# Altium schematic sheet SCH Front Conexion.SchDoc
size Legal; SheetNumber: 3; SheetTotal: 3
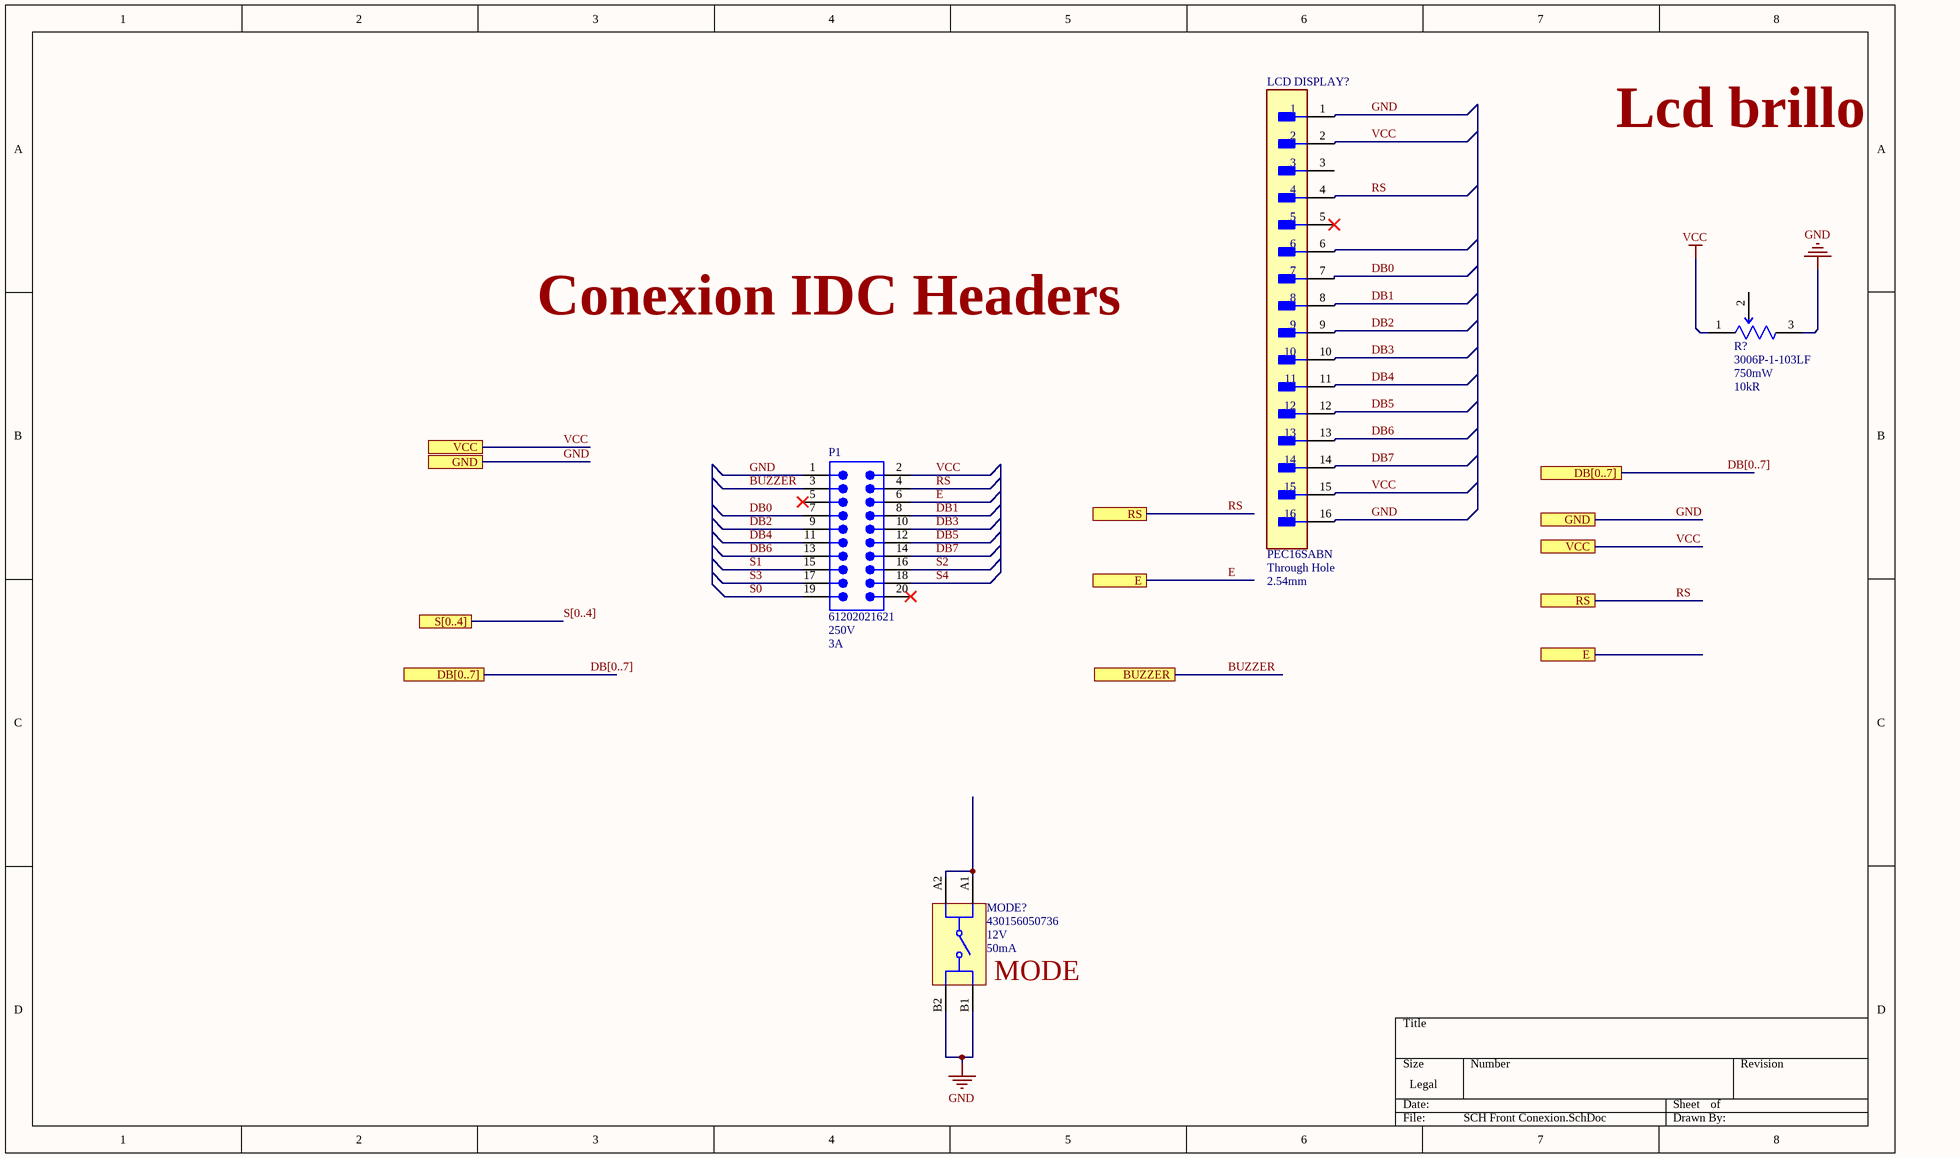
[diagram p0: SCH Front Conexion.SchDoc]

## Parts
LCD_DISPLAY?  PEC16SABN  Mount: Through Hole  Height: 2.54mm  [FP-PEC16SABN-MFG]
MODE?  430156050736  Voltage Rating: 12V  Current Rating: 50mA  [4301x60507x6]
P1  61202021621  Voltage Rating (DC): 250V  Current Rating: 3A  [61202021621]
R?  3006P-1-103LF  Power Rating: 750mW  Resistance: 10kR  [FP-3006P-MFG]

## Ports
BUZZER, DB[0..7], E, GND, RS, S[0..4], VCC

## Nets
GND: LCD_DISPLAY?.1 LCD_DISPLAY?.16 MODE?.B1 MODE?.B2 P1.1 R?.3(CW) ; port GND
VCC: LCD_DISPLAY?.2 LCD_DISPLAY?.15 P1.2 R?.1(CCW) ; port VCC
BUZZER: P1.3 ; port BUZZER
DB0: LCD_DISPLAY?.7 P1.7
DB1: LCD_DISPLAY?.8 P1.8
DB2: LCD_DISPLAY?.9 P1.9
DB3: LCD_DISPLAY?.10 P1.10
DB4: LCD_DISPLAY?.11 P1.11
DB5: LCD_DISPLAY?.12 P1.12
DB6: LCD_DISPLAY?.13 P1.13
DB7: LCD_DISPLAY?.14 P1.14
E: P1.6 ; port E
RS: LCD_DISPLAY?.4 P1.4 ; port RS
S0: P1.19
S1: P1.15
S2: P1.16
S3: P1.17
S4: P1.18
NetMODE?_A1: MODE?.A1 MODE?.A2

Not connected (* = marked no-connect by the designer): LCD_DISPLAY? 3 5* 6; P1 5* 20*; R? 2(WIPER)

## Buses and harness runs
bus DB[0..7] = port DB[0..7]
bus S[0..4] = port S[0..4]

## Notes on the sheet
- Lcd brillo
- Conexion IDC Headers
- (near MODE?) MODE

## Library data of the parts
LCD_DISPLAY? = CMP-25680-000075-1: CONN HEADER VERT 16POS 2.54MM; Gender: Male; Number of Contacts: 16; Connector Type: Male Pin; Pitch: 0.1inch; Contact Type: Male Pin; Lead Free: Lead Free; Packaging: Bulk; Package Quantity: 1; Termination: Solder; Contact Plating: Tin; Color: Black; RoHS Compliant: Yes; Housing Material: Plastic; Contact Mating Length: 0.23inch; Number of Positions: 16; Width: 2.54mm; Contact Material: Bronze; Length: 40.6mm; Housing Color: Black; Number of Rows: 1
MODE? = CMP-1453-00004-2: NexarPartId: 38794700; Illumination Type: Illuminated, Non-Illuminated; Mechanical Life: 200kcycles; Actuator Material: Liquid Crystal Polymer, Polymer; Throw Configuration: SPST; Insulation Resistance: 100MΩ; Switch Function: Off-Mom; Switch Travel: 250µm; Contact Current Rating: 50mA; Height: 5mm; RoHS: Compliant; Width: 6.2mm; Contact Material: Steel; Max Operating Temperature: 85°C; Mount: Through Hole; REACH SVHC: No SVHC; Termination: PC Pin; Min Operating Temperature: -40°C; Length: 6.2mm; Diameter: 3.5mm; Packaging: Bulk; Contact Plating: Silver
P1 = CMP-1502-00010-2: NexarPartId: 8917785; Number of Positions: 20; Row Spacing: 2.54mm; Gender: Male; Insulation Resistance: 1GΩ; Connector Type: Male Pin; Contact Resistance: 20mΩ; Insulation: Insulated; System: Connector; Contact Material: Copper; REACH SVHC: Unknown; Width: 33.06mm; Pitch: 2.54mm; Housing Material: PBT; Number of Contacts: 20; Contact Plating: Gold; Mount: Through Hole; Termination: Through Hole; Number of Pins: 20; Color: Black; Max Operating Temperature: 105°C; Contact Gender: Male; Voltage Rating: 250V; Lead Pitch: 2.54mm; Operating Supply Voltage: 250V; Length: 33.06mm; Orientation: Vertical; Number of Rows: 2; Flammability Rating: UL94 V-0; RoHS: Compliant; Insulation Material: PBT; Min Operating Temperature: -40°C; Height: 8.85mm
R? = CMP-07234-000047-1: TRIMMER 10KOHM 0.75W PC PIN SIDE; Manufacturer Series: 3006; Pin Diameter: 0.6mm; Resistance Tolerance: 10%; Actuator Type: SCREW; Number of Turns: 15; Insulation Resistance: 1GR; Pitch: 2.5mm; Resistance Law: Linear; Temperature Coefficient: 100ppm/°C; Number of Terminals/Pins: 3; Actuator Orientation: Horizontal; Package Quantity: 100; Depth: 4.83mm; Width: 4.83mm; Termination: Pin; Packaging: Rail/Tube; Height: 6.35mm; Terminal Finish: Tin; Color: Blue; Thickness: 5.59mm; Lead Free: Lead Free; Min Operating Temperature: -55°C; Type: Potentiometer; Radiation Hardening: No; Weight: 0.04oz; Mount: Panel; RoHS Compliant: Yes; Length: 20.57mm; Tolerance: 10%; Number of Pins: 3; Taper: Linear; Military Standard: Not; Resistor Type: Cermet; Max Operating Temperature: 125°C; REACH SVHC: No SVHC; Technology: CERMET; Max Power Dissipation: 750mW; Series: 3006